# Altium schematic sheet Main.SchDoc
size A
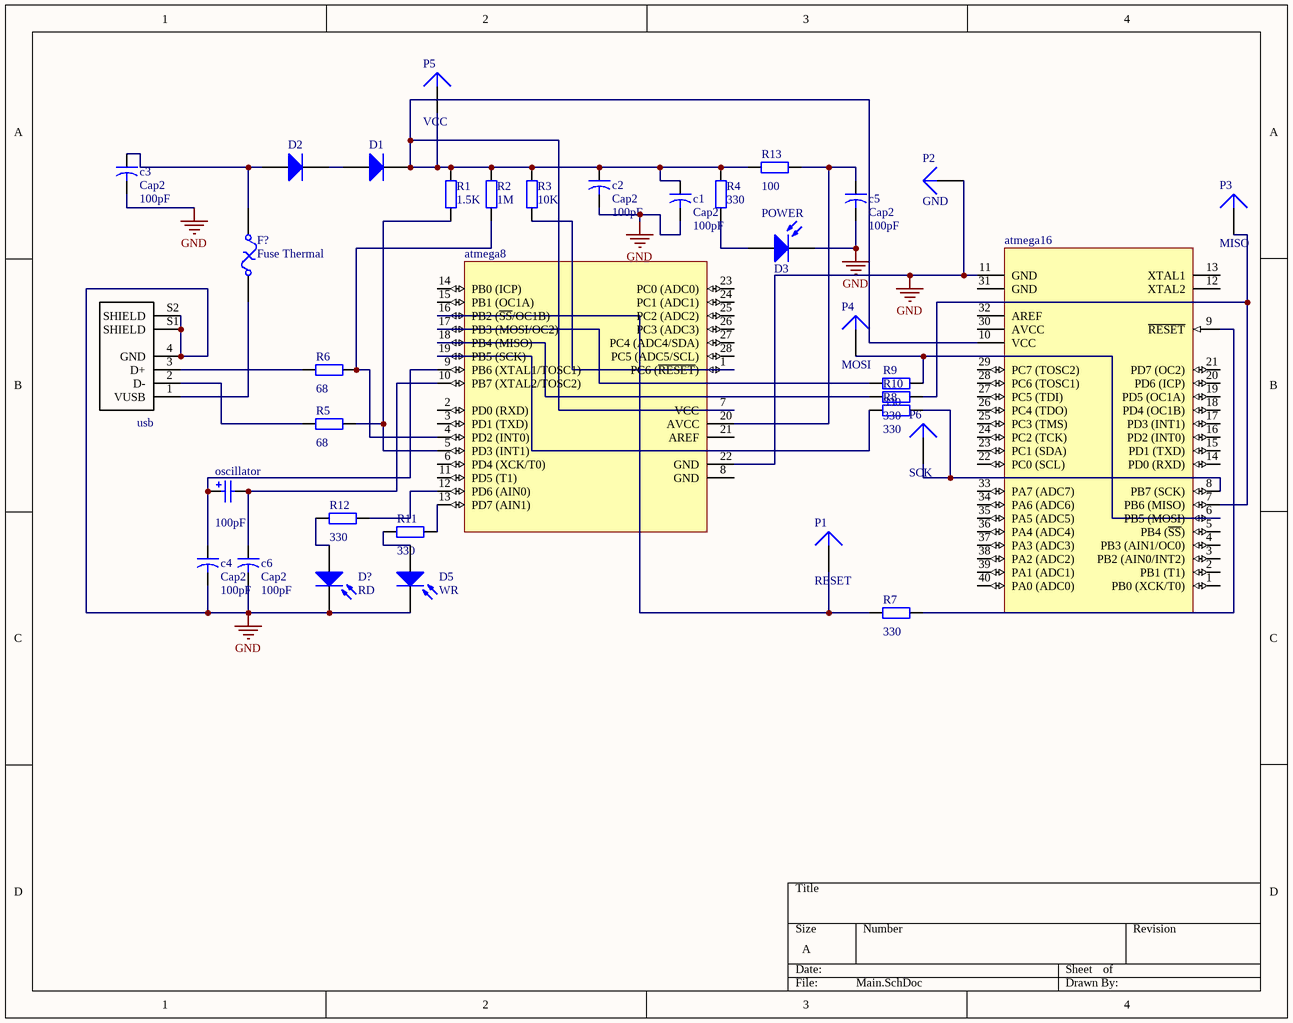
[diagram p0: Main.SchDoc]

## Parts
atmega8  ATmega8-16PI  [My_28P3]  (value not drawn)
atmega16  ATmega16-16PC  [40P6]  (value not drawn)
c1  Cap2  value 100pF  [CAPR5-4X5]
c2  Cap2  value 100pF  [CAPR5-4X5]
c3  Cap2  value 100pF  [CAPR5-4X5]
c4  Cap2  value 100pF  [CAPR5-4X5]
c5  Cap2  value 100pF  [CAPR5-4X5]
c6  Cap2  value 100pF  [CAPR5-4X5]
D1  Diode 1N4007  [DO-41]  (value not drawn)
D2  Diode 1N4007  [DO-41]  (value not drawn)
D3  POWER  [LED-1]
D5  WR  [LED-1]
D?  RD  [LED-1]
F?  Fuse Thermal  [PIN-W2/E2.8]
oscillator  value 100pF  [POLAR0.8]  (hidden comment: Cap Pol2)
P1  RESET  [PIN1]
P2  GND  [PIN1]
P3  MISO  [PIN1]
P4  MOSI  [PIN1]
P5  VCC  [PIN1]
P6  SCK  [PIN1]
R1  value 1.5K  [AXIAL-0.4]  (hidden comment: Res2)
R2  value 1M  [AXIAL-0.4]  (hidden comment: Res2)
R3  value 10K  [AXIAL-0.4]  (hidden comment: Res2)
R4  value 330  [AXIAL-0.4]  (hidden comment: Res2)
R5  value 68  [AXIAL-0.4]  (hidden comment: Res2)
R6  value 68  [AXIAL-0.4]  (hidden comment: Res2)
R7  value 330  [AXIAL-0.4]  (hidden comment: Res2)
R8  value 330  [AXIAL-0.4]  (hidden comment: Res2)
R9  value 330  [AXIAL-0.4]  (hidden comment: Res2)
R10  value 330  [AXIAL-0.4]  (hidden comment: Res2)
R11  value 330  [AXIAL-0.4]  (hidden comment: Res2)
R12  value 330  [AXIAL-0.4]  (hidden comment: Res2)
R13  value 100  [AXIAL-0.4]  (hidden comment: Res2)
usb  USB-A1VSB6  [*ONSHORE_USB-A1VSB6_USB-A1VSB6(Primary)]  (value not drawn)

## Nets
GND: atmega8.22(GND) atmega16.11(GND) c1.2 c2.2 c3.2 c4.2 c5.2 c6.2 D3.2(K) D5.2(K) D?.2(K) P2.1 usb.4(GND) usb.S1(SHIELD) usb.S2(SHIELD)
Netatmega8_1: atmega8.1(PC6_(~{RESET})) R3.2
Netatmega8_4: atmega8.4(PD2_(INT0)) R2.1 R6.2
Netatmega8_5: atmega8.5(PD3_(INT1)) R1.1 R5.2
Netatmega8_7: atmega8.7(VCC) atmega16.10(VCC) c1.1 c2.1 D1.2(K) P5.1 R1.2 R2.2 R3.1 R4.1 R13.1
Netatmega8_9: atmega8.9(PB6_(XTAL1/TOSC1)) c4.1 oscillator.1
Netatmega8_10: atmega8.10(PB7_(XTAL2/TOSC2)) c6.1 oscillator.2
Netatmega8_12: atmega8.12(PD6_(AIN0)) R12.2
Netatmega8_13: atmega8.13(PD7_(AIN1)) R11.2
Netatmega8_16: atmega8.16(PB2_(~{SS}/OC1B)) P1.1 R7.1
Netatmega8_17: atmega8.17(PB3_(MOSI/OC2)) R9.1
Netatmega8_18: atmega8.18(PB4_(MISO)) R10.1
Netatmega8_19: atmega8.19(PB5_(SCK)) R8.1
Netatmega8_20: atmega8.20(AVCC) c5.1 R13.2
Netatmega16_6: atmega16.6(PB5_(MOSI)) P4.1 R9.2
Netatmega16_7: atmega16.7(PB6_(MISO)) P3.1 R10.2
Netatmega16_8: atmega16.8(PB7_(SCK)) P6.1 R8.2
Netatmega16_9: atmega16.9(~{RESET}) R7.2
Netc3_1: c3.1 D2.1(A) F?.2
NetD1_1: D1.1(A) D2.2(K)
NetD3_1: D3.1(A) R4.2
NetD5_1: D5.1(A) R11.1
NetD?_1: D?.1(A) R12.1
NetF?_1: F?.1 usb.1(VUSB)
NetR5_1: R5.1 usb.2(D-)
NetR6_1: R6.1 usb.3(D+)

Not connected (* = marked no-connect by the designer): atmega8 2(PD0_(RXD)) 3(PD1_(TXD)) 6(PD4_(XCK/T0)) 8(GND) 11(PD5_(T1)) 14(PB0_(ICP)) 15(PB1_(OC1A)) 21(AREF) 23(PC0_(ADC0)) 24(PC1_(ADC1)) 25(PC2_(ADC2)) 26(PC3_(ADC3)) 27(PC4_(ADC4/SDA)) 28(PC5_(ADC5/SCL)); atmega16 1(PB0_(XCK/T0)) 2(PB1_(T1)) 3(PB2_(AIN0/INT2)) 4(PB3_(AIN1/OC0)) 5(PB4_(~{SS})) 12(XTAL2) 13(XTAL1) 14(PD0_(RXD)) 15(PD1_(TXD)) 16(PD2_(INT0)) 17(PD3_(INT1)) 18(PD4_(OC1B)) 19(PD5_(OC1A)) 20(PD6_(ICP)) 21(PD7_(OC2)) 22(PC0_(SCL)) 23(PC1_(SDA)) 24(PC2_(TCK)) 25(PC3_(TMS)) 26(PC4_(TDO)) 27(PC5_(TDI)) 28(PC6_(TOSC1)) 29(PC7_(TOSC2)) 30(AVCC) 31(GND) 32(AREF) 33(PA7_(ADC7)) 34(PA6_(ADC6)) 35(PA5_(ADC5)) 36(PA4_(ADC4)) 37(PA3_(ADC3)) 38(PA2_(ADC2)) 39(PA1_(ADC1)) 40(PA0_(ADC0))

## Library data of the parts
atmega8 = ATmega8-16PI: AVR 8K Bytes of In-System Programmable Flash Memory; Published: 17-Sep-2003; LatestRevisionDate: 04-Mar-2005; LatestRevisionNote: Stylized 3D Model Added.; DatasheetVersion: 2486H-AVR-09/02; PackageVersion: revB, Sep-2001; PackageReference: 28P3; Publisher: Altium Limited; PackageDescription: DIP; 28 Leads; Row Spacing 7.62 mm; Pitch 2.54 mm; ComponentLink1Description: Manufacturer Link; ComponentLink1URL: http://www.atmel.com; ComponentLink2Description: Datasheet; ComponentLink2URL: http://www.atmel.com/dyn/resources/prod_documents/doc2486.pdf
atmega16 = ATmega16-16PC: 8-Bit AVR Microcontroller with 16K Bytes of In-System Programmable Flash Memory; Package Information: Latest Revision: Dec-1999; Published: 17-Sep-2003; Datasheet: Latest Revision: 2466E-AVR-10/02; Package Reference: 40P6; Publisher: Altium Limited
c1-c6 = Cap2: Capacitor; Published: 23-Sep-2002; PackageReference: CAPR5-4X5; Publisher: Altium Limited; PackageDescription: Capacitor; 2 Leads
D1 D2 = Diode 1N4007: 1 Amp General Purpose Rectifier; Published: 8-Jun-2000; LatestRevisionDate: 17-Jul-2002; LatestRevisionNote: Re-released for DXP Platform.; DatasheetVersion: 1998; PackageVersion: Aug-1999; PackageReference: DO-41; Publisher: Altium Limited; PackageDescription: Diode, Axial; Body 5.2 x 2.7 mm (LxDia. max), Lead Dia. 0.86 mm (max); Code_JEDEC: DO-204-AL; ComponentLink1Description: Manufacturer Link; ComponentLink1URL: http://www.fairchildsemi.com/; ComponentLink2Description: Datasheet; ComponentLink2URL: http://www.fairchildsemi.com/ds/1N%2F1N4001.pdf
D3 D5 D? = LED IR 5mm: Typical LED; Designer: Seyed Mohsen Ghasemian; Published: 07/31/2012; PackageReference: LED; Publisher: www.picpars.com; PackageDescription: LED; 2 Leads
F? = Fuse Thermal: Thermal Fuse; Published: 24-Mar-1999; LatestRevisionDate: 17-Jul-2002; LatestRevisionNote: Re-released for DXP Platform.; PackageReference: PIN-W2/E2.8; Publisher: Altium Limited; PackageDescription: Thru-Hole; 2 Leads
oscillator = Cap Pol2: Polarized Capacitor (Axial); Published: 8-Jun-2000; LatestRevisionDate: 17-Jul-2002; LatestRevisionNote: Re-released for DXP Platform.; PackageReference: POLAR0.8; Publisher: Altium Limited; PackageDescription: Polarized Capacitor; 2 Leads
P1-P6 = Plug: LatestRevisionDate: 17-Jul-2002; LatestRevisionNote: Re-released for DXP Platform.; Publisher: Altium Limited
R1-R13 = Res2: Resistor; Published: 8-Jun-2000; LatestRevisionDate: 17-Jul-2002; LatestRevisionNote: Re-released for DXP Platform.; PackageReference: AXIAL-0.4; Publisher: Altium Limited; PackageDescription: Axial Device, Thru-Hole; 2 Leads; 0.4 in Pin Spacing
usb = USB-A1VSB6: Conn Usb Type a Vertical Black; MF: On Shore; MP: USB-A1VSB6; Package: None; Availability: Unavailable; Price: None; SnapEDA_Link: https://www.snapeda.com/parts/USB-A1VSB6/On%20Shore%20Technology%20Inc./view-part/?ref=snap; Value: *